# EAGLE design untitled (EAGLE 7.2.0)
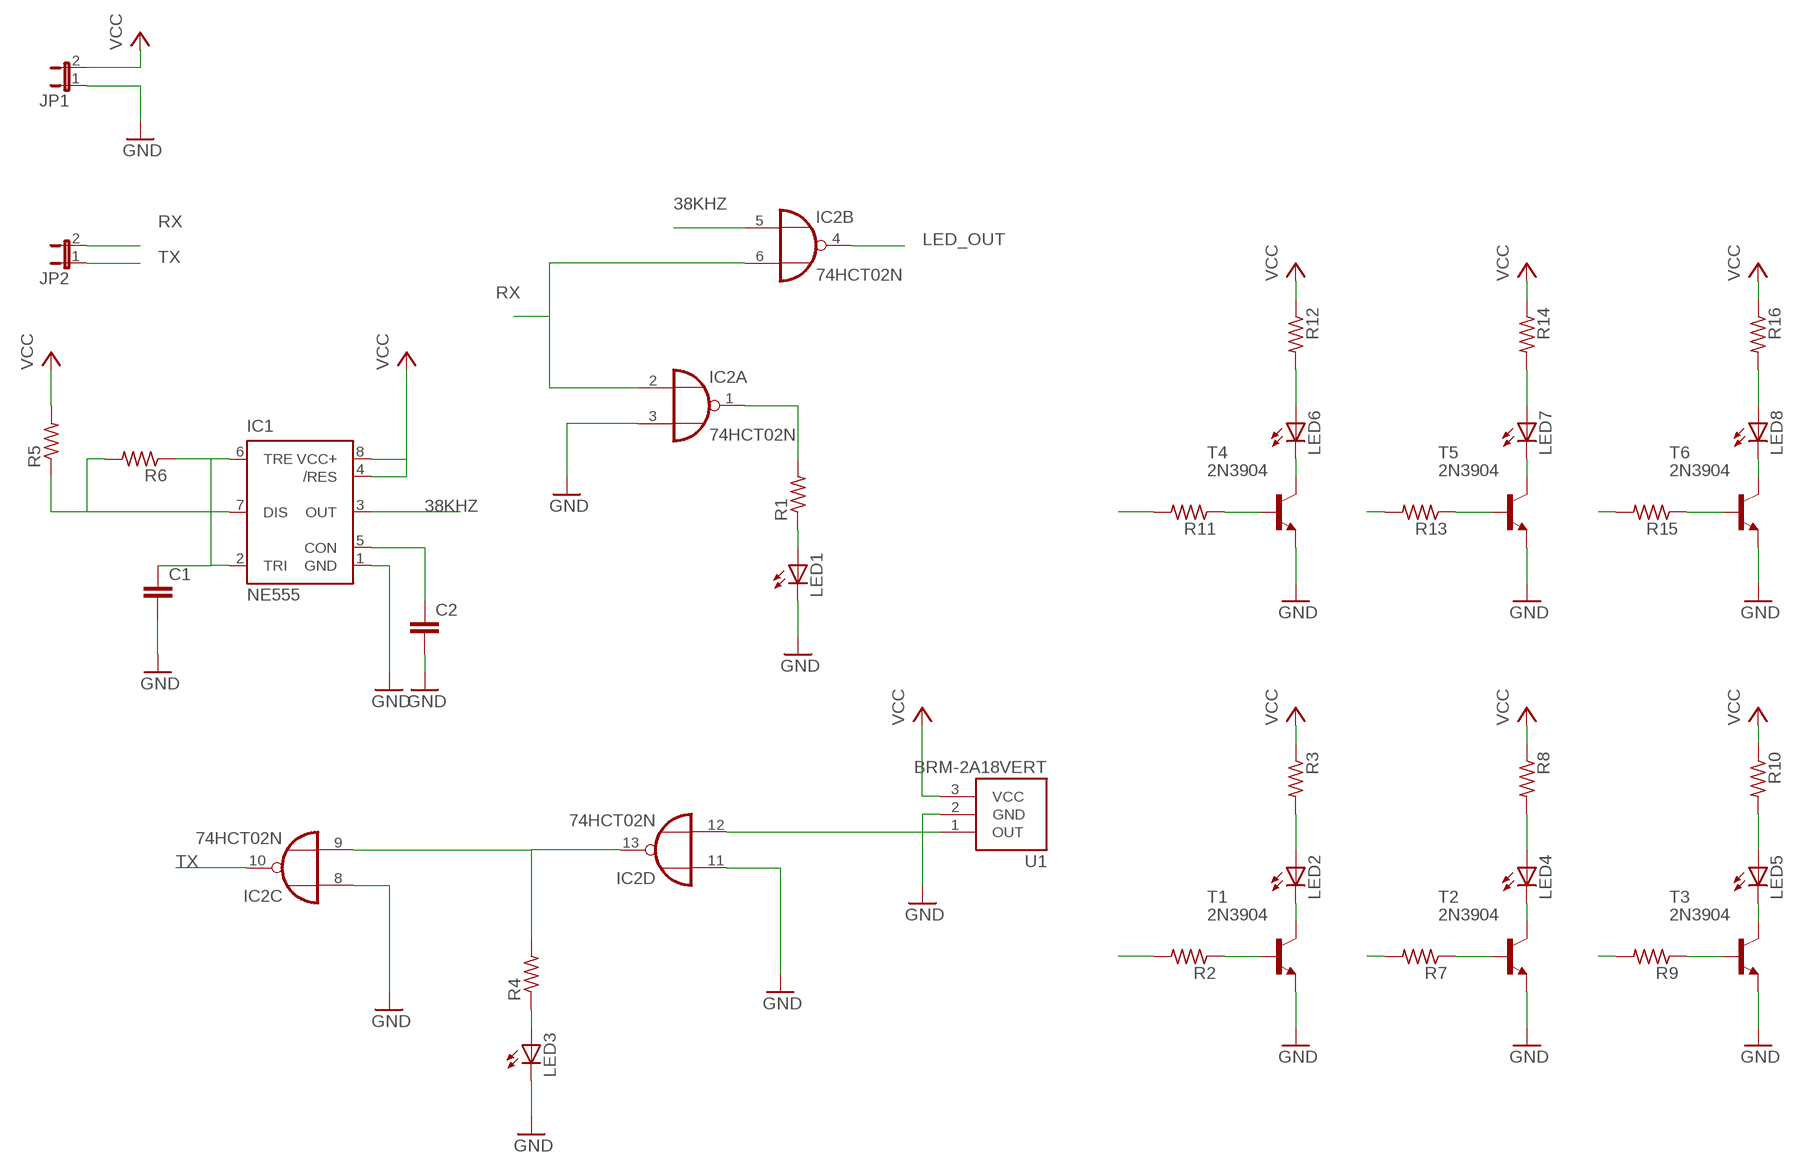
[diagram p0: schematic, sheet 1]

## Parts
C1  CAPKIT  [CAP-PTH-SMALL-KIT]
C2  CAPKIT  [CAP-PTH-SMALL-KIT]
IC1  NE555  [DIL-08]
IC2  74HCT02N  [DIL14]
JP1  JP1E  [JP1]
JP2  JP1E  [JP1]
LED1  LED5MM  [LED5MM]
LED2  LED5MM  [LED5MM]
LED3  LED5MM  [LED5MM]
LED4  LED5MM  [LED5MM]
LED5  LED5MM  [LED5MM]
LED6  LED5MM  [LED5MM]
LED7  LED5MM  [LED5MM]
LED8  LED5MM  [LED5MM]
R1  R-US_0207/10  [0207/10]
R2  R-US_0207/10  [0207/10]
R3  R-US_0207/10  [0207/10]
R4  R-US_0207/10  [0207/10]
R5  R-US_0207/10  [0207/10]
R6  R-US_0207/10  [0207/10]
R7  R-US_0207/10  [0207/10]
R8  R-US_0207/10  [0207/10]
R9  R-US_0207/10  [0207/10]
R10  R-US_0207/10  [0207/10]
R11  R-US_0207/10  [0207/10]
R12  R-US_0207/10  [0207/10]
R13  R-US_0207/10  [0207/10]
R14  R-US_0207/10  [0207/10]
R15  R-US_0207/10  [0207/10]
R16  R-US_0207/10  [0207/10]
T1  2N3904  [TO92]
T2  2N3904  [TO92]
T3  2N3904  [TO92]
T4  2N3904  [TO92]
T5  2N3904  [TO92]
T6  2N3904  [TO92]
U1  BRM-2A18VERT  [BRM-2508_VERT]

## Nets
38KHZ: IC1.3(OUT) IC2.5(B:I0)
GND: C1.2 C2.2 IC1.1(GND) IC2.3(A:I1) IC2.8(C:I0) IC2.11(D:I0) JP1.1 LED1.K(C) LED3.K(C) T1.3(E) T2.3(E) T3.3(E) T4.3(E) T5.3(E) T6.3(E) U1.2(GND)
LED_OUT: IC2.4(B:O) R2.2 R7.2 R9.2 R11.2 R13.2 R15.2
N$1: LED3.A R4.1
N$2: LED1.A R1.1
N$3: IC2.1(A:O) R1.2
N$5: R2.1 T1.2(B)
N$6: LED2.A R3.2
N$7: LED2.K(C) T1.1(C)
N$8: IC2.9(C:I1) IC2.13(D:O) R4.2
N$9: R7.1 T2.2(B)
N$10: IC2.12(D:I1) U1.1(OUT)
N$11: LED4.A R8.2
N$12: LED4.K(C) T2.1(C)
N$13: IC1.7(DIS) R5.1 R6.2
N$14: C1.1 IC1.2(TRI) IC1.6(TRE) R6.1
N$15: C2.1 IC1.5(CON)
N$16: R9.1 T3.2(B)
N$17: LED5.A R10.2
N$18: LED5.K(C) T3.1(C)
N$19: R11.1 T4.2(B)
N$20: LED6.A R12.2
N$21: LED6.K(C) T4.1(C)
N$22: R13.1 T5.2(B)
N$23: LED7.A R14.2
N$24: LED7.K(C) T5.1(C)
N$25: R15.1 T6.2(B)
N$26: LED8.A R16.2
N$27: LED8.K(C) T6.1(C)
RX: IC2.2(A:I0) IC2.6(B:I1) JP2.2
TX: IC2.10(C:O) JP2.1
VCC: IC1.4(/RES) IC1.8(VCC+) JP1.2 R3.1 R5.2 R8.1 R10.1 R12.1 R14.1 R16.1 U1.3(VCC)

## Power pins joined to a net without a drawn wire
GND: IC2.7(P:GND)
VCC: IC2.14(P:VCC)

## Library data of the parts
C1 C2 = SparkFun-Passives:CAP: Capacitor Standard 0603 ceramic capacitor, and 0.1" leaded capacitor.
IC1 = st-microelectronics:NE555: General purpose bipolar Timer; MF: Arrow Electronics; MPN: NE555N; OC_FARNELL: 1467742; OC_NEWARK: 89K1486
IC2 = 74xx-eu:74*02: Quad 2-input NOR gate
JP1 JP2 = jumper:JP1E: JUMPER
LED1-LED8 = led:LED: LED OSRAM: - CHIPLED LG R971, LG N971, LY N971, LG Q971, LY Q971, LO R971, LY R971 LH N974, LH R974 LS Q976, LO Q976, LY Q976 LO Q996 - Hyper CHIPLED LW Q18S LB Q993, LB Q99A, LB R99A - SideLED LS A670, LO A670, LY A670, LG A670, LP A670 LB A673, LV A673, LT A673, LW A673 LH A674 LY A675 LS A676, LA A676, LO A676, LY A676, LW A676 LS A679, LY A679, LG A679 - Hyper Micro SIDELED® LS Y876, LA Y876, LO Y876, LY Y876 LT Y87S - SmartLED LW L88C, LW L88S LB L89C, LB L89S, LG L890 LS L89K, LO L89K, LY L89K LS L896, LA L896, LO L896, LY L896 - TOPLED LS T670, LO T670, LY T670, LG T670, LP T670 LSG T670, LSP T670, LSY T670, LOP T670, LYG T670 LG T671, LOG T671, LSG T671 LB T673, LV T673, LT T673, LW T673 LH T674 LS T676, LA T676, LO T676, LY T676, LB T676, LH T676, LSB T676, LW T676 LB T67C, LV T67C, LT T67C, LS T67K, LO T67K, LY T67K, LW E67C LS E67B, LA E67B, LO E67B, LY E67B, LB E67C, LV E67C, LT E67C LW T67C LS T679, LY T679, LG T679 LS T770, LO T770, LY T770, LG T770, LP T770 LB T773, LV T773, LT T773, LW T773 LH T774 LS E675, LA E675, LY E675, LS T675 LS T776, LA T776, LO T776, LY T776, LB T776 LHGB T686 LT T68C, LB T68C - Hyper Mini TOPLED® LB M676 - Mini TOPLED Santana® LG M470 LS M47K, LO M47K, LY M47K Source: http://www.osram.convergy.de LUXEON: - LUMILED® LXK2-PW12-R00, LXK2-PW12-S00, LXK2-PW14-U00, LXK2-PW14-V00 LXK2-PM12-R00, LXK2-PM12-S00, LXK2-PM14-U00 LXK2-PE12-Q00, LXK2-PE12-R00, LXK2-PE12-S00, LXK2-PE14-T00, LXK2-PE14-U00 LXK2-PB12-K00, LXK2-PB12-L00, LXK2-PB12-M00, LXK2-PB14-N00, LXK2-PB14-P00, LXK2-PB14-Q00 LXK2-PR12-L00, LXK2-PR12-M00, LXK2-PR14-Q00, LXK2-PR14-R00 LXK2-PD12-Q00, LXK2-PD12-R00, LXK2-PD12-S00 LXK2-PH12-R00, LXK2-PH12-S00 LXK2-PL12-P00, LXK2-PL12-Q00, LXK2-PL12-R00 Source: www.luxeon.com KINGBRIGHT: KA-3528ASYC Source: www.kingbright.com
R1-R16 = resistor:R-US_: RESISTOR, American symbol
T1-T6 = transistor:2N3904: NPN TRANSISTOR
U1 = SparkFun-Sensors:BRM-2A18: BRM-2A18 IR receiver.; PROD_ID: COMP-12505

## Board
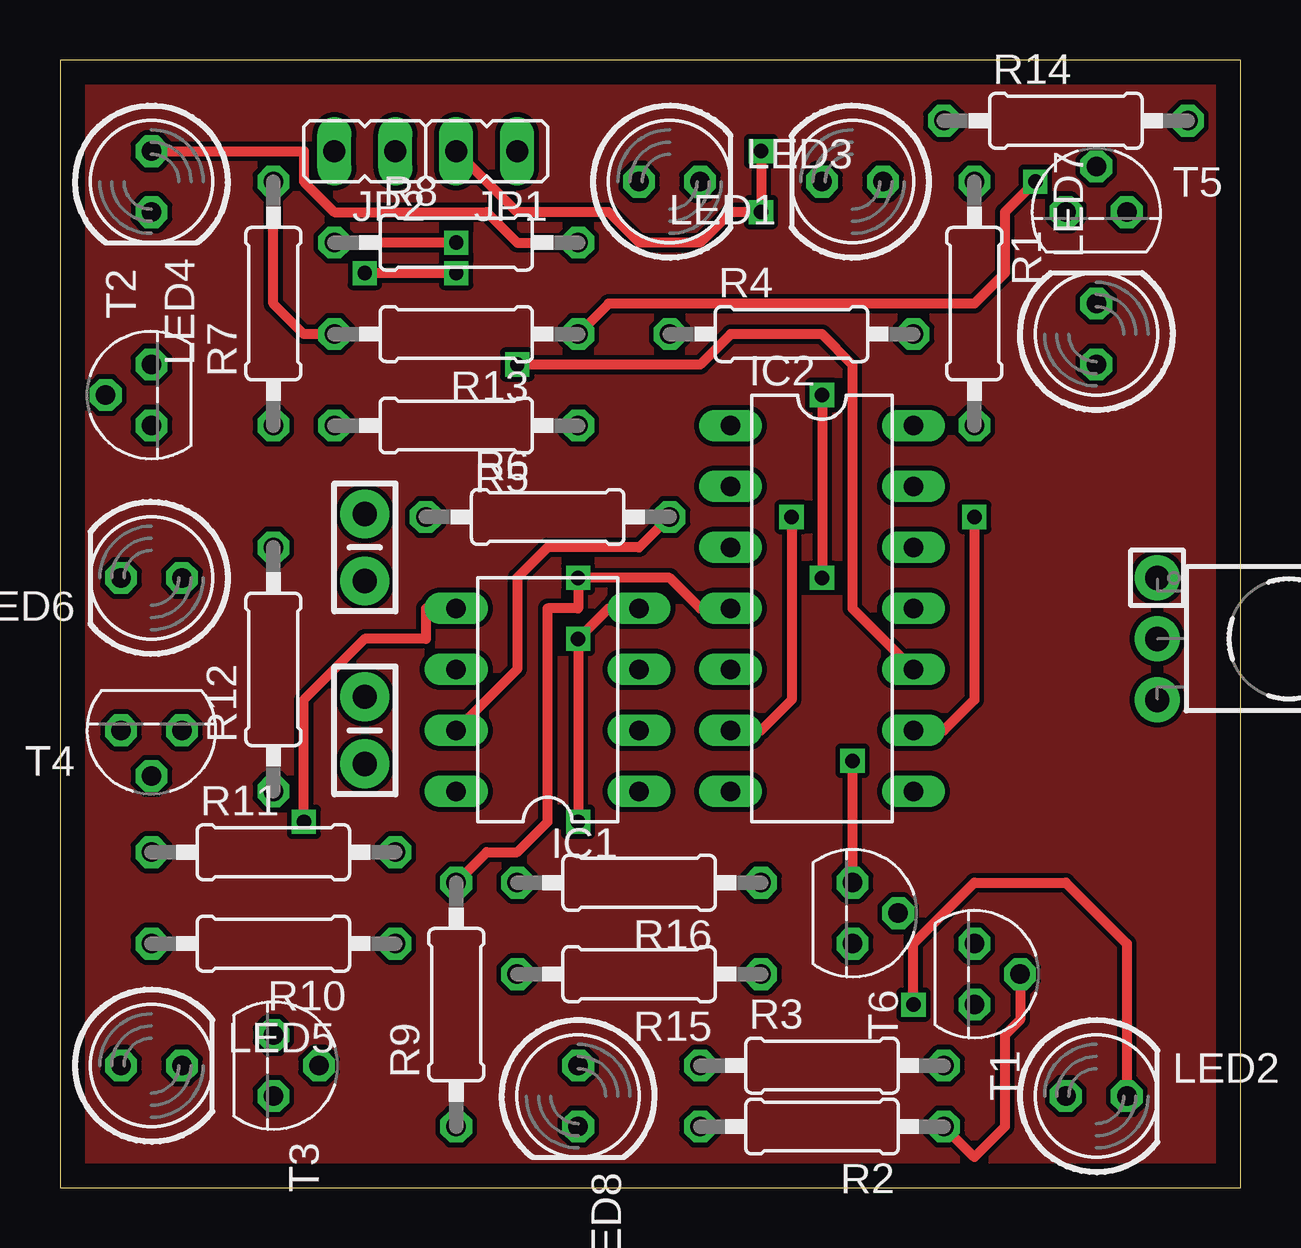
[diagram p1: board, top side]
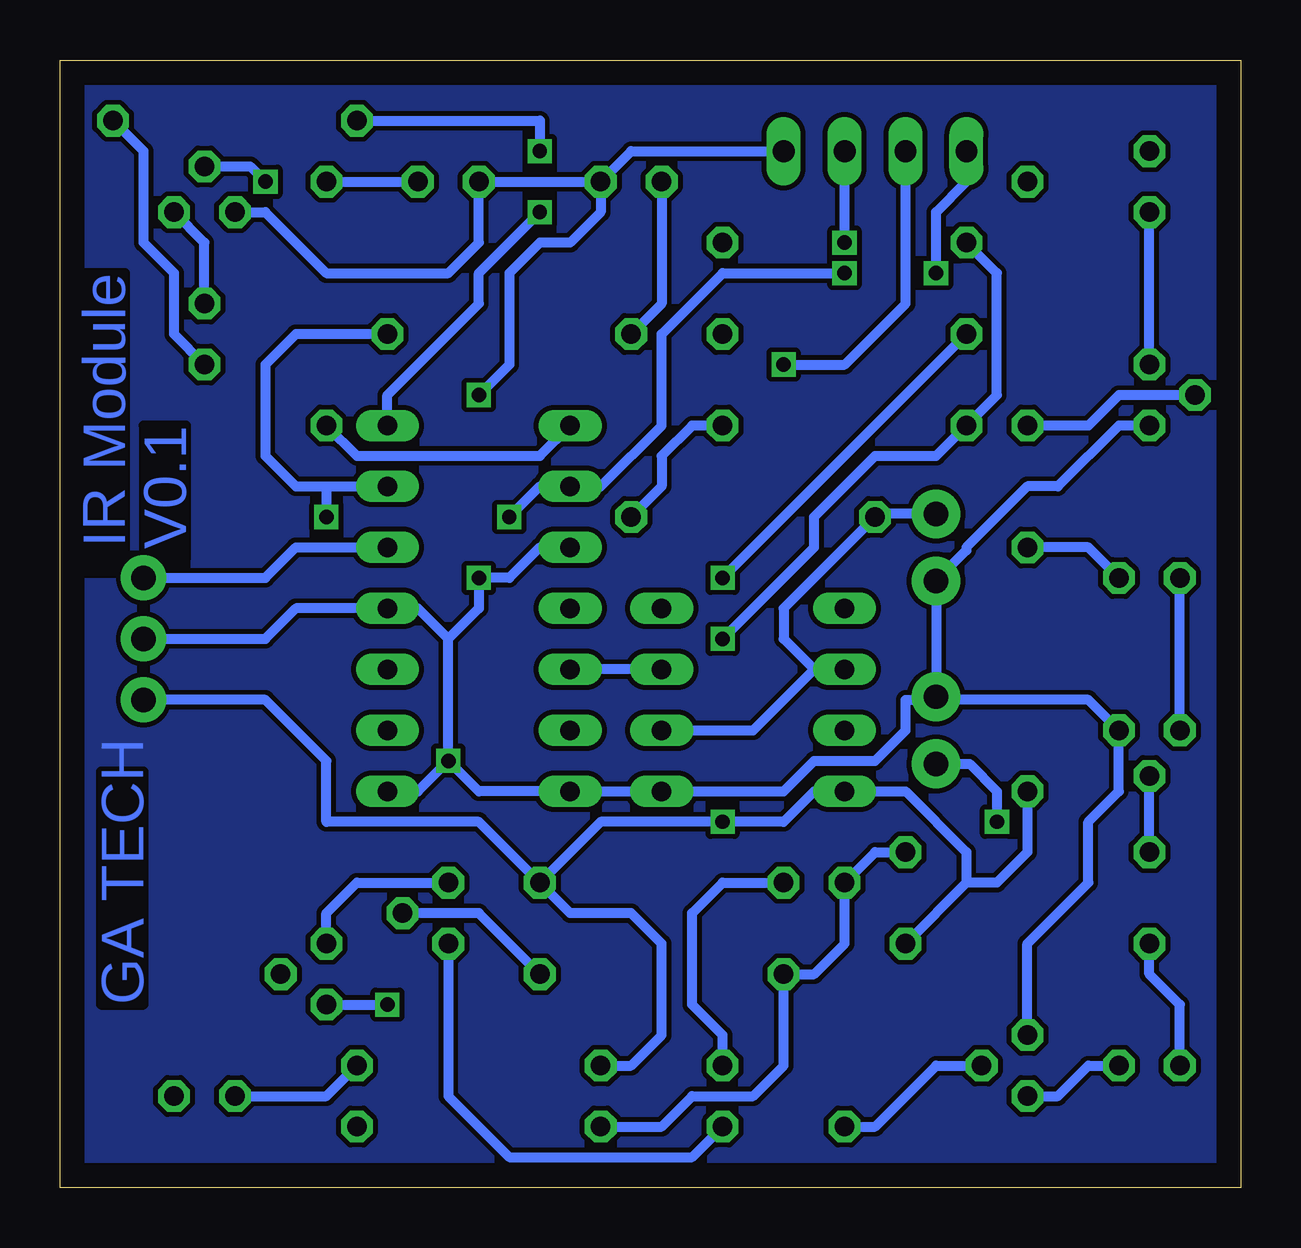
[diagram p2: board, bottom side, seen from below]

Size 49.2 x 46.98 mm. Coordinates in mm from the lower left corner, seen from the top.
Outline: 0,0 49.2,0 49.2,46.98 0,46.98 0,0
Copper layers (1*16): Top 0.035mm / dielectric 1.5mm / Bottom 0.035mm
Design rules "default": minimum track width 10mil, minimum drill 24mil, track to track 8mil, track to pad 8mil, pad to pad 8mil, via to via 8mil, smd to smd 8mil, copper to edge 40mil, drill to drill 8mil, minimum pad ring 10mil, minimum via ring 8mil, stop-mask expansion 4mil, vias tented up to drill 0mil, thermal gap 10mil

### Footprints (pad centres in the part's own frame; a part is rotated, then mirrored left to right if it is on the bottom)
CAP-PTH-SMALL-KIT = drill 1.016 pad 2.032: 1 -1.397,0; 2 1.397,0
DIL-08 = drill 0.813 long: 1 -3.81,-3.81; 2 -1.27,-3.81; 3 1.27,-3.81; 4 3.81,-3.81; 5 3.81,3.81; 6 1.27,3.81; 7 -1.27,3.81; 8 -3.81,3.81
DIL14 = drill 0.813 long: 1 -7.62,-3.81; 2 -5.08,-3.81; 3 -2.54,-3.81; 4 0,-3.81; 5 2.54,-3.81; 6 5.08,-3.81; 7 7.62,-3.81; 8 7.62,3.81; 9 5.08,3.81; 10 2.54,3.81; 11 0,3.81; 12 -2.54,3.81; 13 -5.08,3.81; 14 -7.62,3.81
JP1 = drill 0.914 long: 1 0,-1.27; 2 0,1.27
LED5MM = drill 0.813 octagon: A -1.27,0; K 1.27,0
0207/10 = drill 0.813 octagon: 1 -5.08,0; 2 5.08,0
TO92 = drill 0.813 octagon: 1 1.27,0; 2 0,1.905; 3 -1.27,0
BRM-2508_VERT = drill 1.016 pad 1.88: 1 -2.54,0; 2 0,0; 3 2.54,0

### Placement (x,y rotation side)
C1  12.7,26.67 270 top
C2  12.7,19.05 90 top
IC1  20.32,20.32 90 top
IC2  31.75,24.13 270 top
JP1  17.78,43.18 90 top
JP2  12.7,43.18 90 top
LED1  33.02,41.91 180 top
LED2  43.18,3.81 0 top
LED3  25.4,41.91 0 top
LED4  3.81,41.91 270 top
LED5  3.81,5.08 0 top
LED6  3.81,25.4 180 top
LED7  43.18,35.56 90 top
LED8  21.59,3.81 270 top
R1  38.1,36.83 270 top
R2  31.75,2.54 180 top
R3  31.75,5.08 0 top
R4  30.48,35.56 0 top
R5  16.51,31.75 180 top
R6  20.32,27.94 0 top
R7  8.89,36.83 90 top
R8  16.51,39.37 0 top
R9  16.51,7.62 90 top
R10  8.89,10.16 180 top
R11  8.89,13.97 0 top
R12  8.89,21.59 90 top
R13  16.51,35.56 180 top
R14  41.91,44.45 0 top
R15  24.13,8.89 180 top
R16  24.13,12.7 180 top
T1  38.1,8.89 270 top
T2  3.81,33.02 90 top
T3  8.89,5.08 270 top
T4  3.81,19.05 180 top
T5  43.18,40.64 0 top
T6  33.02,11.43 270 top
U1  45.72,22.86 270 top

### Tracks (layer width: path | path; a pad name or v marks a point on that pad's centre or on a via)
38KHZ
  Bottom 0.406: IC1.3 IC2.5
GND  (via drill 0.6)
  Top 0.406: v33.02,17.78 T6.3 | v31.75,33.02 v31.75,25.4
  Bottom 0.406: U1.2 40.64,22.86 39.37,24.13 IC2.11 34.29,24.13 33.02,22.86 | C2.2 12.83,20.32 13.97,20.32 13.97,19.05 15.24,17.78 17.78,17.78 19.05,16.51 IC1.1 IC2.7 | T5.3 40.64,40.64 38.1,38.1 33.02,38.1 31.75,39.37 LED1.K LED3.K | LED3.K 25.4,43.18 JP1.1 | LED3.K 26.67,40.64 27.94,39.37 29.21,39.37 30.48,38.1 30.48,34.29 v31.75,33.02 | T1.3 38.1,11.43 36.83,12.7 T6.3 | T3.3 8.89,10.16 6.35,12.7 6.35,15.24 5.08,16.51 T4.3 6.35,20.32 12.57,20.32 C2.2 | C2.2 C1.2 11.43,26.54 11.43,26.67 8.89,29.21 7.62,29.21 5.08,31.75 T2.3 | v33.02,17.78 34.29,16.51 IC2.8 | v33.02,17.78 33.02,22.86 | IC2.3 29.21,26.67 30.48,25.4 v31.75,25.4 31.75,24.13 33.02,22.86 | 26.67,16.51 IC2.7 | IC2.7 31.75,16.51 v33.02,17.78
LED_OUT  (via drill 0.6)
  Top 0.406: R9.2 17.78,13.97 19.05,13.97 20.32,15.24 20.32,24.13 21.59,24.13 v21.59,25.4 25.4,25.4 26.67,24.13 IC2.4 | R13.2 10.16,35.56 8.89,36.83 R7.2
  Bottom 0.406: R2.2 24.13,2.54 22.86,3.81 20.32,3.81 19.05,5.08 R15.2 17.78,8.89 16.51,10.16 R9.2 15.24,13.97 R11.2 | v21.59,25.4 R13.2
N$1
  Bottom 0.406: LED3.A 24.13,36.83 R4.1
N$2
  Bottom 0.406: R1.1 LED1.A
N$3
  Bottom 0.406: R1.2 36.83,30.48 29.21,30.48 IC2.1
N$4
  pour Bottom: 0,46.99 49.53,46.99 49.53,0 0,0
N$5
  Top 0.406: T1.2 40.01,6.99 39.37,6.35 39.37,2.54 38.1,1.27 R2.1
N$6
  Bottom 0.406: LED2.A 38.1,3.81 R3.2
N$7  (via drill 0.6)
  Top 0.406: v35.56,7.62 35.56,10.16 38.1,12.7 41.91,12.7 44.45,10.16 LED2.K
  Bottom 0.406: T1.1 v35.56,7.62
N$8  (via drill 0.6)
  Top 0.406: v38.1,27.94 38.1,20.32 36.83,19.05 IC2.9
  Bottom 0.406: R4.2 39.37,35.56 40.64,34.29 40.64,30.48 39.37,29.21 38.1,29.21 | 38.1,29.21 v38.1,27.94 | 38.1,29.21 IC2.13
N$9
  Bottom 0.406: T2.2 5.08,33.02 6.35,31.75 R7.1
N$10
  Bottom 0.406: U1.1 40.64,25.4 39.37,26.67 IC2.12
N$11
  Top 0.406: LED4.A 10.16,43.18 10.16,41.91 11.43,40.64 17.78,40.64 19.05,39.37 R8.2
N$12
  Bottom 0.406: T2.1 LED4.K
N$13
  Top 0.406: R6.2 24.13,26.67 20.32,26.67 19.05,25.4 19.05,21.59 IC1.7
  Bottom 0.406: R5.1 22.86,31.75 24.13,30.48 24.13,29.21 R6.2
N$14
  Bottom 0.406: C1.1 15.11,28.07 R6.1 19.05,24.13 19.05,22.86 17.78,21.59 | 17.78,21.59 IC1.6 | IC1.2 20.32,19.05 17.78,21.59
N$15  (via drill 0.6)
  Top 0.406: v10.16,15.24 10.16,20.32 12.7,22.86 15.24,22.86 15.24,24.13 IC1.5
  Bottom 0.406: C2.1 11.3,17.65 10.16,16.51 v10.16,15.24
N$16
  Bottom 0.406: R9.1 15.24,2.54 12.7,5.08 T3.2
N$17
  Bottom 0.406: LED5.A 2.54,7.62 3.81,8.89 R10.2
N$18
  Bottom 0.406: T3.1 7.62,3.81 6.35,5.08 LED5.K
N$19
  Bottom 0.406: R11.1 T4.2
N$20
  Bottom 0.406: LED6.A 6.35,26.67 R12.2
N$21
  Bottom 0.406: T4.1 LED6.K
N$22  (via drill 0.6)
  Top 0.406: v40.64,41.91 39.37,40.64 39.37,38.1 38.1,36.83 22.86,36.83 R13.1
  Bottom 0.406: T5.2 41.27,42.55 v40.64,41.91
N$23
  Bottom 0.406: LED7.A 44.45,35.56 44.45,38.1 45.72,39.37 45.72,43.18 R14.2
N$24
  Bottom 0.406: LED7.K 43.18,39.37 T5.1
N$25
  Bottom 0.406: R15.1 31.75,11.43 T6.2
N$26
  Bottom 0.406: LED8.A 21.59,6.35 22.86,7.62 22.86,11.43 21.59,12.7 R16.2
N$27
  Bottom 0.406: T6.1 33.02,3.81 30.48,1.27 22.86,1.27 LED8.K
N$28
  pour Top: 0,46.99 49.53,46.99 49.53,0 0,0
RX  (via drill 0.6)
  Top 0.406: v16.51,38.1 v12.7,38.1 | v30.48,27.94 30.48,20.32 29.21,19.05 IC2.6
  Bottom 0.406: v16.51,38.1 21.59,38.1 24.13,35.56 24.13,31.75 26.67,29.21 IC2.2 29.21,29.21 v30.48,27.94 | v12.7,38.1 12.7,40.64 11.43,41.91 JP2.2
TX  (via drill 0.6)
  Top 0.406: v19.05,34.29 26.67,34.29 27.94,35.56 31.75,35.56 33.02,34.29 33.02,24.13 IC2.10
  Bottom 0.406: v19.05,34.29 16.51,34.29 13.97,36.83 JP2.1
VCC  (via drill 0.6)
  Top 0.406: IC1.4 22.86,24.13 v21.59,22.86 v21.59,15.24 | v29.21,43.18 v29.21,40.64 27.94,40.64 26.67,39.37 24.13,39.37 22.86,40.64 19.05,40.64 JP1.2 | v16.51,39.37 R8.1
  Bottom 0.406: R16.1 31.75,15.24 38.1,15.24 38.1,17.78 40.64,20.32 U1.3 | R3.1 25.4,5.08 24.13,6.35 24.13,10.16 25.4,11.43 27.94,11.43 R16.1 | R12.1 8.89,13.97 10.16,12.7 11.43,12.7 | 11.43,12.7 R10.1 | 11.43,12.7 11.43,13.97 13.97,16.51 IC1.8 17.78,16.51 19.05,15.24 v21.59,15.24 26.67,15.24 R16.1 | R8.1 10.16,38.1 10.16,33.02 R5.2 12.7,30.48 15.24,30.48 17.78,27.94 17.78,26.67 v21.59,22.86 | R14.1 29.21,44.45 v29.21,43.18 | v16.51,39.37 JP1.2 | IC2.14 35.56,33.02 31.75,36.83 31.75,38.1 v29.21,40.64

### Text on the board
Bottom: IR Module | V0.1 | GA TECH